# EasyEDA schematic Collecteur Estomac Yeux Bouche.json
TITLE: Sheet_1; REV: 1.0; Date: 2020-09-23; Sheet: 1/1; Company: Your Company
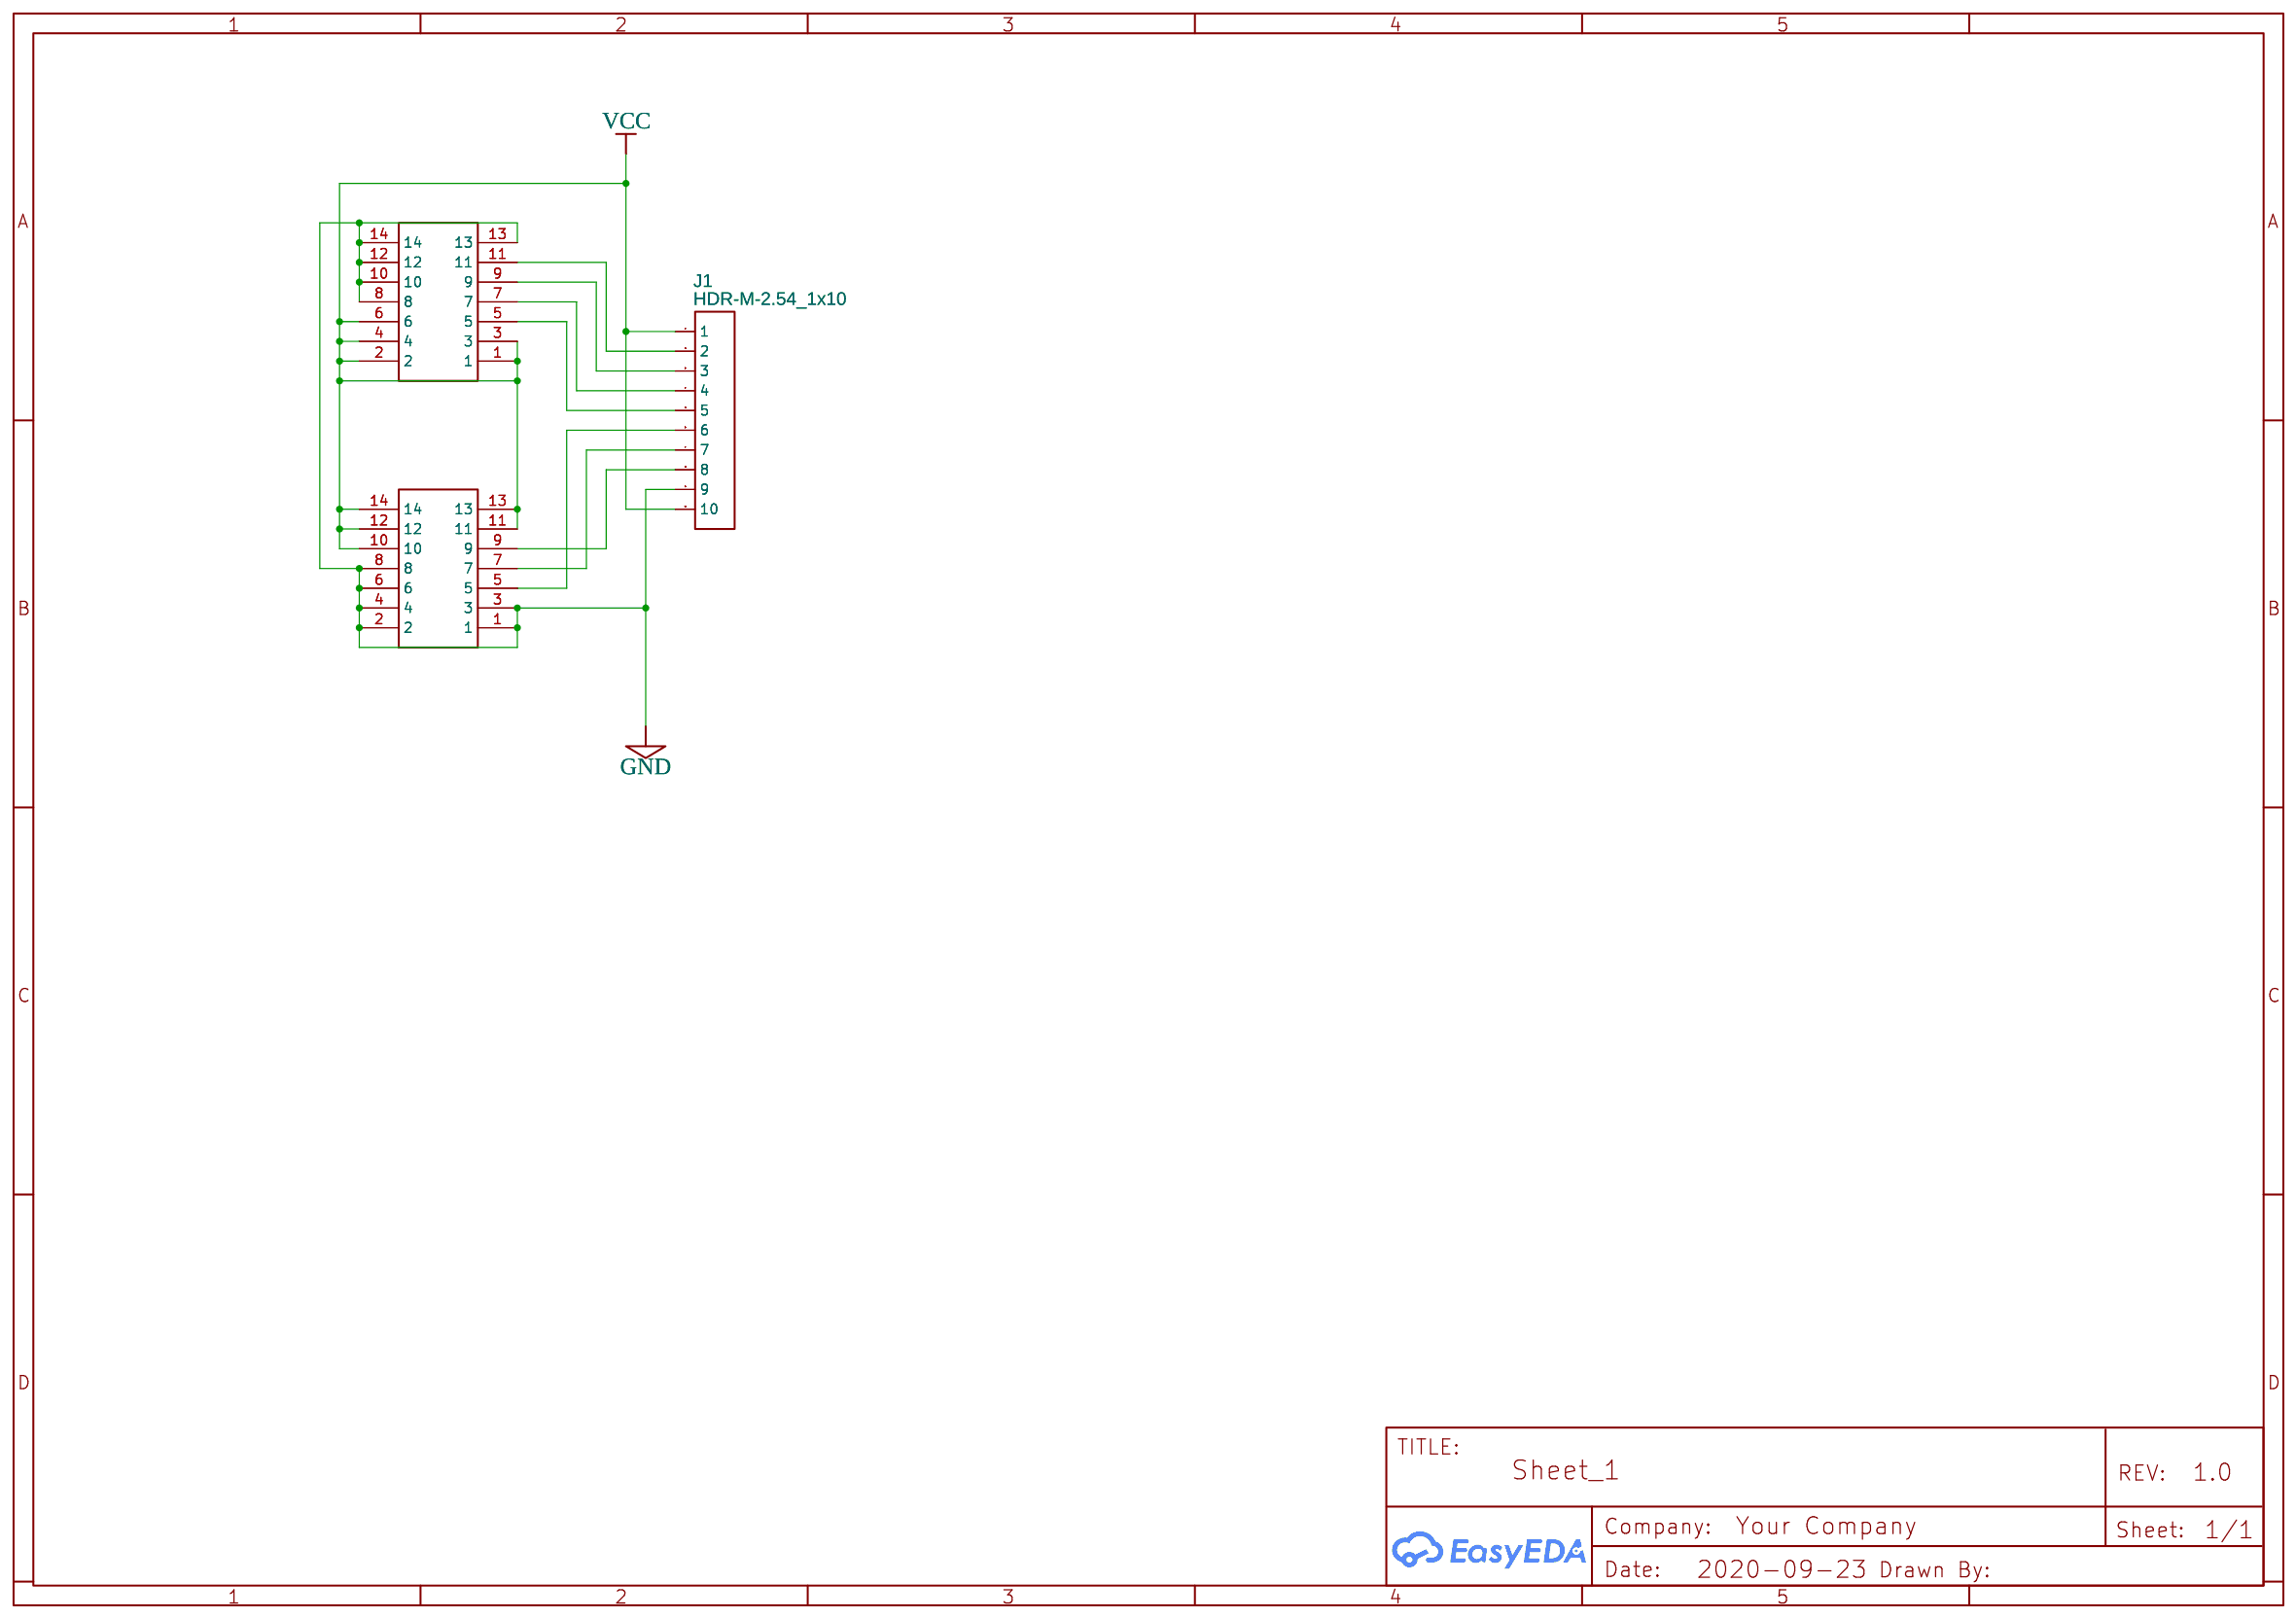
[diagram p0: schematic sheet]

## Parts
J1  HDR-M-2.54_1x10  [HDR-M-2.54_1X10]
OUT1  Horn connector/2.0mm2*7P  [IDC-TH_14P-P2.00-V-M-R2-C7-S2.00]
OUT3  Horn connector/2.0mm2*7P  [IDC-TH_14P-P2.00-V-M-R2-C7-S2.00]

## Library data of the parts
J1 = HDR-M-2.54_1x10: Supplier Part: C57369; Supplier: LCSC; Contributor: LCEDA_Lib
OUT1 OUT3 = Horn connector/2.0mm2*7P: Supplier: LCSC; Manufacturer: BOOMELE; Manufacturer Part: Horn connector/2.0mm2*7P直简牛; Supplier Part: C29428

## Nets
GND: J1.9 OUT1.1 OUT1.2 OUT1.3 OUT1.4 OUT1.6 OUT1.8 OUT3.8 OUT3.10 OUT3.12 OUT3.13 OUT3.14
VCC: J1.1 J1.10 OUT1.10 OUT1.11 OUT1.12 OUT1.13 OUT1.14 OUT3.1 OUT3.2 OUT3.3 OUT3.4 OUT3.6
Net-(J1-2): J1.2 OUT3.11
Net-(J1-3): J1.3 OUT3.9
Net-(J1-4): J1.4 OUT3.7
Net-(J1-5): J1.5 OUT3.5
Net-(J1-6): J1.6 OUT1.5
Net-(J1-7): J1.7 OUT1.7
Net-(J1-8): J1.8 OUT1.9
